# EAGLE schematic NanoPiNeo-shield (EAGLE 7.7.0)
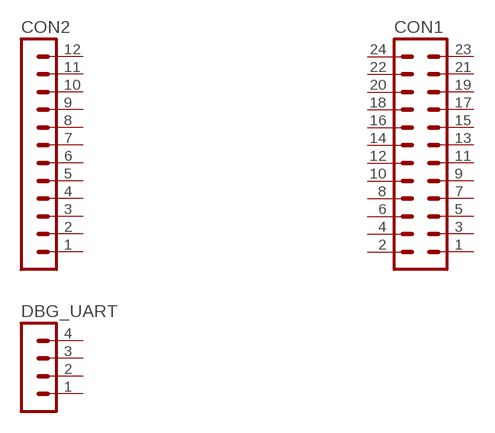
[diagram p0: schematic, sheet 1]

## Parts
CON1  MA12-2  [MA12-2]
CON2  MA12-1  [MA12-1]
DBG_UART  MA04-1  [MA04-1]
Unconnected: CON1.1 CON1.2 CON1.3 CON1.4 CON1.5 CON1.6 CON1.7 CON1.8 CON1.9 CON1.10 CON1.11 CON1.12 CON1.13 CON1.14 CON1.15 CON1.16 CON1.17 CON1.18 CON1.19 CON1.20 CON1.21 CON1.22 CON1.23 CON1.24 CON2.1 CON2.2 CON2.3 CON2.4 CON2.5 CON2.6 CON2.7 CON2.8 CON2.9 CON2.10 CON2.11 CON2.12 DBG_UART.1 DBG_UART.2 DBG_UART.3 DBG_UART.4

## Library data of the parts
CON1 = con-lstb:MA12-2: PIN HEADER; OC_FARNELL: unknown; OC_NEWARK: unknown
CON2 = con-lstb:MA12-1: PIN HEADER; OC_FARNELL: unknown; OC_NEWARK: unknown
DBG_UART = con-lstb:MA04-1: PIN HEADER; OC_FARNELL: unknown; OC_NEWARK: unknown